# Altium schematic sheet 02-FPGA_Banks.SchDoc
size A4; Author: Fabian Castaño; CompanyName: GIBIC Tech-Hub; Engineer: Fabian Castaño; Organization: Universidad de Antioquia; Address1: UdeA; Address2: Medellín; Address3: Antioquia; Address4: Colombia 050010
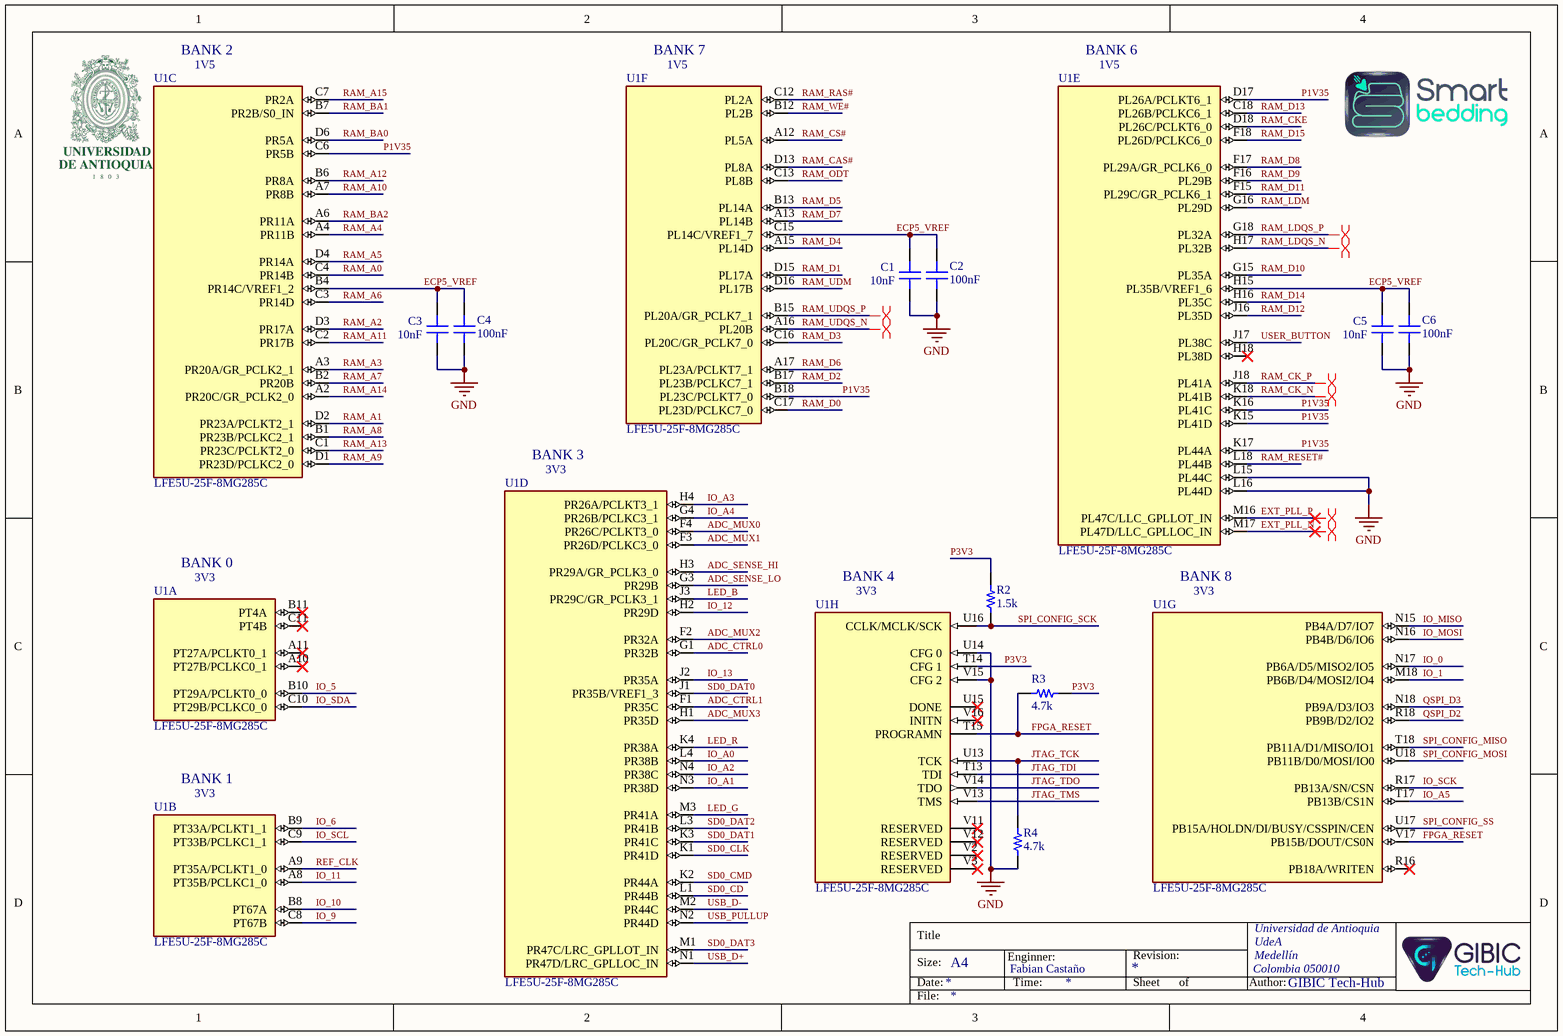
[diagram p0: 02-FPGA_Banks.SchDoc]

## Parts
C1  10nF  [CAP 0201_0603]
C2  100nF  [CAP 0201_0603]
C3  10nF  [CAP 0201_0603]
C4  100nF  [CAP 0201_0603]
C5  10nF  [CAP 0201_0603]
C6  100nF  [CAP 0201_0603]
R2  1.5k  [RES 0201_0603]
R3  4.7k  [RES 0201_0603]
R4  4.7k  [RES 0201_0603]
U1  LFE5U-25F-8MG285C  [FP-cBGA-LFE5U]  (parts A,B,C,D,E,F,G,H of 13)

## Nets
GND: C1.1 C2.1 C3.1 C4.1 C5.1 C6.1 R4.2 U1.L15(PL44C) U1.L16(PL44D) U1.U14(CFG_0) U1.V15(CFG_2)
ADC_CTRL0: U1.G1(PR32B)
ADC_CTRL1: U1.F1(PR35C)
ADC_MUX0: U1.F4(PR26C/PCLKT3_0)
ADC_MUX1: U1.F3(PR26D/PCLKC3_0)
ADC_MUX2: U1.F2(PR32A)
ADC_MUX3: U1.H1(PR35D)
ADC_SENSE_HI: U1.H3(PR29A/GR_PCLK3_0)
ADC_SENSE_LO: U1.G3(PR29B)
ECP5_VREF: C1.2 C2.2 C3.2 C4.2 C5.2 C6.2 U1.B4(PR14C/VREF1_2) U1.C15(PL14C/VREF1_7) U1.H15(PL35B/VREF1_6)
EXT_PLL_N: U1.M17(PL47D/LLC_GPLLOC_IN)
EXT_PLL_P: U1.M16(PL47C/LLC_GPLLOT_IN)
FPGA_RESET: R3.2 U1.T15(PROGRAMN) U1.V17(PB15B/DOUT/CS0N)
IO_0: U1.N17(PB6A/D5/MISO2/IO5)
IO_1: U1.M18(PB6B/D4/MOSI2/IO4)
IO_5: U1.B10(PT29A/PCLKT0_0)
IO_6: U1.B9(PT33A/PCLKT1_1)
IO_9: U1.C8(PT67B)
IO_10: U1.B8(PT67A)
IO_11: U1.A8(PT35B/PCLKC1_0)
IO_12: U1.H2(PR29D)
IO_13: U1.J2(PR35A)
IO_A0: U1.L4(PR38B)
IO_A1: U1.N3(PR38D)
IO_A2: U1.N4(PR38C)
IO_A3: U1.H4(PR26A/PCLKT3_1)
IO_A4: U1.G4(PR26B/PCLKC3_1)
IO_A5: U1.T17(PB13B/CS1N)
IO_MISO: U1.N15(PB4A/D7/IO7)
IO_MOSI: U1.N16(PB4B/D6/IO6)
IO_SCK: U1.R17(PB13A/SN/CSN)
IO_SCL: U1.C9(PT33B/PCLKC1_1)
IO_SDA: U1.C10(PT29B/PCLKC0_0)
JTAG_TCK: R4.1 U1.U13(TCK)
JTAG_TDI: U1.T13(TDI)
JTAG_TDO: U1.V14(TDO)
JTAG_TMS: U1.V13(TMS)
LED_B: U1.J3(PR29C/GR_PCLK3_1)
LED_G: U1.M3(PR41A)
LED_R: U1.K4(PR38A)
P1V35: U1.B18(PL23C/PCLKT7_0) U1.C6(PR5B) U1.D17(PL26A/PCLKT6_1) U1.K15(PL41D) U1.K16(PL41C) U1.K17(PL44A)
P3V3: R2.1 R3.1 U1.T14(CFG_1)
QSPI_D2: U1.R18(PB9B/D2/IO2)
QSPI_D3: U1.N18(PB9A/D3/IO3)
RAM_A0: U1.C4(PR14B)
RAM_A1: U1.D2(PR23A/PCLKT2_1)
RAM_A2: U1.D3(PR17A)
RAM_A3: U1.A3(PR20A/GR_PCLK2_1)
RAM_A4: U1.A4(PR11B)
RAM_A5: U1.D4(PR14A)
RAM_A6: U1.C3(PR14D)
RAM_A7: U1.B2(PR20B)
RAM_A8: U1.B1(PR23B/PCLKC2_1)
RAM_A9: U1.D1(PR23D/PCLKC2_0)
RAM_A10: U1.A7(PR8B)
RAM_A11: U1.C2(PR17B)
RAM_A12: U1.B6(PR8A)
RAM_A13: U1.C1(PR23C/PCLKT2_0)
RAM_A14: U1.A2(PR20C/GR_PCLK2_0)
RAM_A15: U1.C7(PR2A)
RAM_BA0: U1.D6(PR5A)
RAM_BA1: U1.B7(PR2B/S0_IN)
RAM_BA2: U1.A6(PR11A)
RAM_CAS#: U1.D13(PL8A)
RAM_CK_N: U1.K18(PL41B)
RAM_CK_P: U1.J18(PL41A)
RAM_CKE: U1.D18(PL26C/PCLKT6_0)
RAM_CS#: U1.A12(PL5A)
RAM_D0: U1.C17(PL23D/PCLKC7_0)
RAM_D1: U1.D15(PL17A)
RAM_D2: U1.B17(PL23B/PCLKC7_1)
RAM_D3: U1.C16(PL20C/GR_PCLK7_0)
RAM_D4: U1.A15(PL14D)
RAM_D5: U1.B13(PL14A)
RAM_D6: U1.A17(PL23A/PCLKT7_1)
RAM_D7: U1.A13(PL14B)
RAM_D8: U1.F17(PL29A/GR_PCLK6_0)
RAM_D9: U1.F16(PL29B)
RAM_D10: U1.G15(PL35A)
RAM_D11: U1.F15(PL29C/GR_PCLK6_1)
RAM_D12: U1.J16(PL35D)
RAM_D13: U1.C18(PL26B/PCLKC6_1)
RAM_D14: U1.H16(PL35C)
RAM_D15: U1.F18(PL26D/PCLKC6_0)
RAM_LDM: U1.G16(PL29D)
RAM_LDQS_N: U1.H17(PL32B)
RAM_LDQS_P: U1.G18(PL32A)
RAM_ODT: U1.C13(PL8B)
RAM_RAS#: U1.C12(PL2A)
RAM_RESET#: U1.L18(PL44B)
RAM_UDM: U1.D16(PL17B)
RAM_UDQS_N: U1.A16(PL20B)
RAM_UDQS_P: U1.B15(PL20A/GR_PCLK7_1)
RAM_WE#: U1.B12(PL2B)
REF_CLK: U1.A9(PT35A/PCLKT1_0)
SD0_CD: U1.L1(PR44B)
SD0_CLK: U1.K1(PR41D)
SD0_CMD: U1.K2(PR44A)
SD0_DAT0: U1.J1(PR35B/VREF1_3)
SD0_DAT1: U1.K3(PR41C)
SD0_DAT2: U1.L3(PR41B)
SD0_DAT3: U1.M1(PR47C/LRC_GPLLOT_IN)
SPI_CONFIG_MISO: U1.T18(PB11A/D1/MISO/IO1)
SPI_CONFIG_MOSI: U1.U18(PB11B/D0/MOSI/IO0)
SPI_CONFIG_SCK: R2.2 U1.U16(CCLK/MCLK/SCK)
SPI_CONFIG_SS: U1.U17(PB15A/HOLDN/DI/BUSY/CSSPIN/CEN)
USB_D+: U1.N1(PR47D/LRC_GPLLOC_IN)
USB_D-: U1.M2(PR44C)
USB_PULLUP: U1.N2(PR44D)
USER_BUTTON: U1.J17(PL38C)

Not connected (* = marked no-connect by the designer): U1 A10(PT27B/PCLKC0_1)* A11(PT27A/PCLKT0_1)* B11(PT4A)* C11(PT4B)* H18(PL38D)* R16(PB18A/WRITEN)* U15(DONE)* V2(RESERVED)* V3(RESERVED)* V11(RESERVED)* V12(RESERVED)* V16(INITN)*

## Layout directives
differential pair: EXT_PLL_N, EXT_PLL_P, RAM_CK_N, RAM_CK_P, RAM_LDQS_N, RAM_LDQS_P, RAM_UDQS_N, RAM_UDQS_P

## Notes on the sheet
- BANK 2
- 1V5
- BANK 7
- BANK 6
- BANK 3
- 3V3
- BANK 0
- BANK 4
- (near U1) BANK 8
- BANK 1
- Title
- Size:
- Date:
- A4
- Enginner:
- Time:
- Revision:
- Sheet
- of
- Author:
- File:

## Library data of the parts
C1 C3 C5 = 0201ZC103JAT2A: CAP CER 10000PF 10V X7R 0201; manufacturer: AVX Corporation; Tolerance: ±5%; Part Number: 0201ZC103JAT2A; Value: 10nF; Applications: General Purpose; Capacitance: 10000pF; componentlink1description: Datasheet; componentlink1url: http://datasheets.avx.com/X7RDielectric.pdf; componentlink2description: DigiKey Link; componentlink2url: http://digikey.com/product-detail/en/avx-corporation/0201ZC103JAT2A/478-10776-1-ND/7536320; Device Package: 0201 (0603 Metric); lastupdated: 2/09/2020 12:59:12 a. m.; Lifecycle Status: Active; Minimum Order: 1; Mounting Type: Surface Mount, MLCC; Operating Temperature: -55°C ~ 125°C; Package / Case: 0201 (0603 Metric); packaging: TapeAndReel; partid: 786; Part Status: Active; price: 0.01; series: -; Size / Dimension: 0.024" L x 0.012" W (0.60mm x 0.30mm); Supplier 1: DigiKey; Supplier Part Number 1: 478-10776-1-ND; Temperature Coefficient: X7R; Thickness (Max): 0.013" (0.33mm); Voltage - Rated: 10V
C2 C4 C6 = GRT033C80J104KE01J: CAP CER 0.1UF 6.3V X6S 0201; manufacturer: Murata Electronics; Capacitance: 0.1 µF; Tolerance: ±10%; Part Number: GRT033C80J104KE01J; Value: 100nF; Applications: Automotive; componentlink1description: Datasheet; componentlink1url: https://search.murata.co.jp/Ceramy/image/img/A01X/G101/ENG/GRT033C80J104KE01-01.pdf; componentlink2description: DigiKey Link; componentlink2url: https://www.digikey.com/en/products/detail/murata-electronics/GRT033C80J104KE01J/13905086; Device Package: 0201 (0603 Metric); lastupdated: 3/01/2023 8:00:58 p. m.; Lifecycle Status: Active; Minimum Order: 1; Mounting Type: Surface Mount, MLCC; Operating Temperature: -55°C ~ 105°C; Package / Case: 0201 (0603 Metric); packaging: CutTape; partid: 29730; Part Status: Active; price: 0.01; Ratings: AEC-Q200; series: GRT; Size / Dimension: 0.024" L x 0.012" W (0.60mm x 0.30mm); Supplier 1: DigiKey; Supplier Part Number 1: 490-GRT033C80J104KE01JCT-ND; Temperature Coefficient: X6S; Thickness (Max): 0.013" (0.33mm); Voltage - Rated: 6.3V
R2-R4 = ERA-1AEB103C: RES SMD 10K OHM 0.1% 1/20W 0201; Manufacturer: Panasonic Electronic Components; Power (Watts): 0.05W, 1/20W; Resistance: 10 kOhms; Temperature Coefficient: ±25ppm/°C; Part Number: ERA-1AEB103C; ComponentLink1Description: Datasheet; ComponentLink1URL: https://industrial.panasonic.com/cdbs/www-data/pdf/RDM0000/AOA0000C307.pdf; ComponentLink2Description: DigiKey Link; ComponentLink2URL: https://www.digikey.com/en/products/detail/panasonic-electronic-components/ERA-1AEB103C/5035568; Composition: Thin Film; Device Package: 0201 (0603 Metric); Features: Automotive AEC-Q200; Height - Seated (Max): 0.010" (0.26mm); LastUpdated: 3/01/2023 8:15:23 p. m.; Lifecycle Status: Active; Minimum Order: 1; Number of Terminations: 2; Operating Temperature: -55°C ~ 155°C; Package / Case: 0201 (0603 Metric); Packaging: TapeAndReel; PartId: 598; Part Status: Active; Price: 0.06; Ratings: AEC-Q200; Series: ERA-1A; Size / Dimension: 0.024" L x 0.012" W (0.60mm x 0.30mm); Supplier 1: DigiKey; Supplier Part Number 1: P10KBXCT-ND; Supplier Device Package: 0201; Tolerance: ±0.1%
  R2: Value: 1.5k
  R3 R4: Value: 4.7k
U1 = LFE5U-25F-8MG285C: FPGA LatticeECP5 Family 24000 Cells 40nm Technology 1.1V 285-Pin CSFBGA